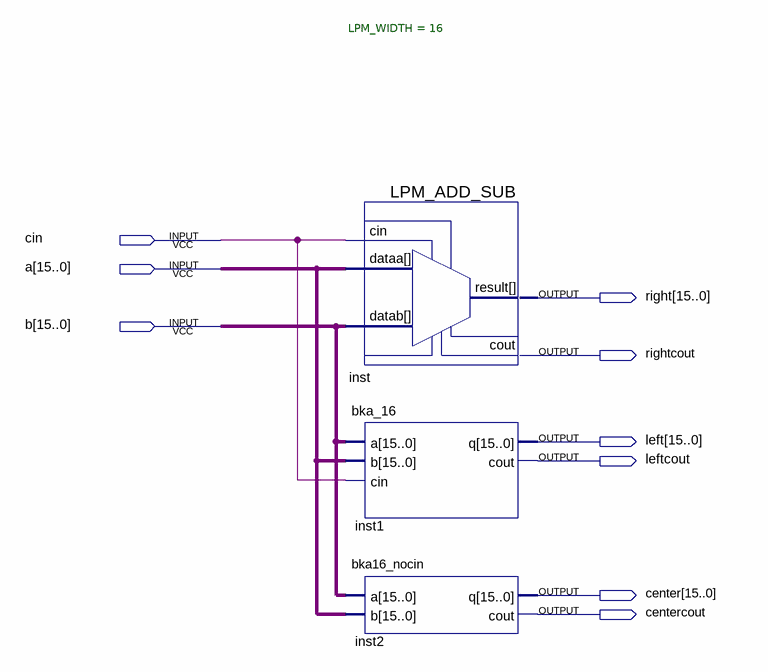
[diagram p0: schematic sheet]
// Quartus schematic adder_correctness.bdf as structural Verilog: 3 symbols, 9 pins
module adder_correctness (
  input  cin,
  input  [15:0] a,
  input  [15:0] b,
  output [15:0] right,
  output rightcout,
  output [15:0] left,
  output leftcout,
  output [15:0] center,
  output centercout
);

  LPM_ADD_SUB #(.LPM_WIDTH(16)) inst (.cin(cin), .dataa(a), .datab(b), .cout(rightcout), .result(right));
  bka_16 inst1 (.a(b), .b(a), .cin(cin), .q(left), .cout(leftcout));
  bka16_nocin inst2 (.a(b), .b(a), .q(center), .cout(centercout));
endmodule
